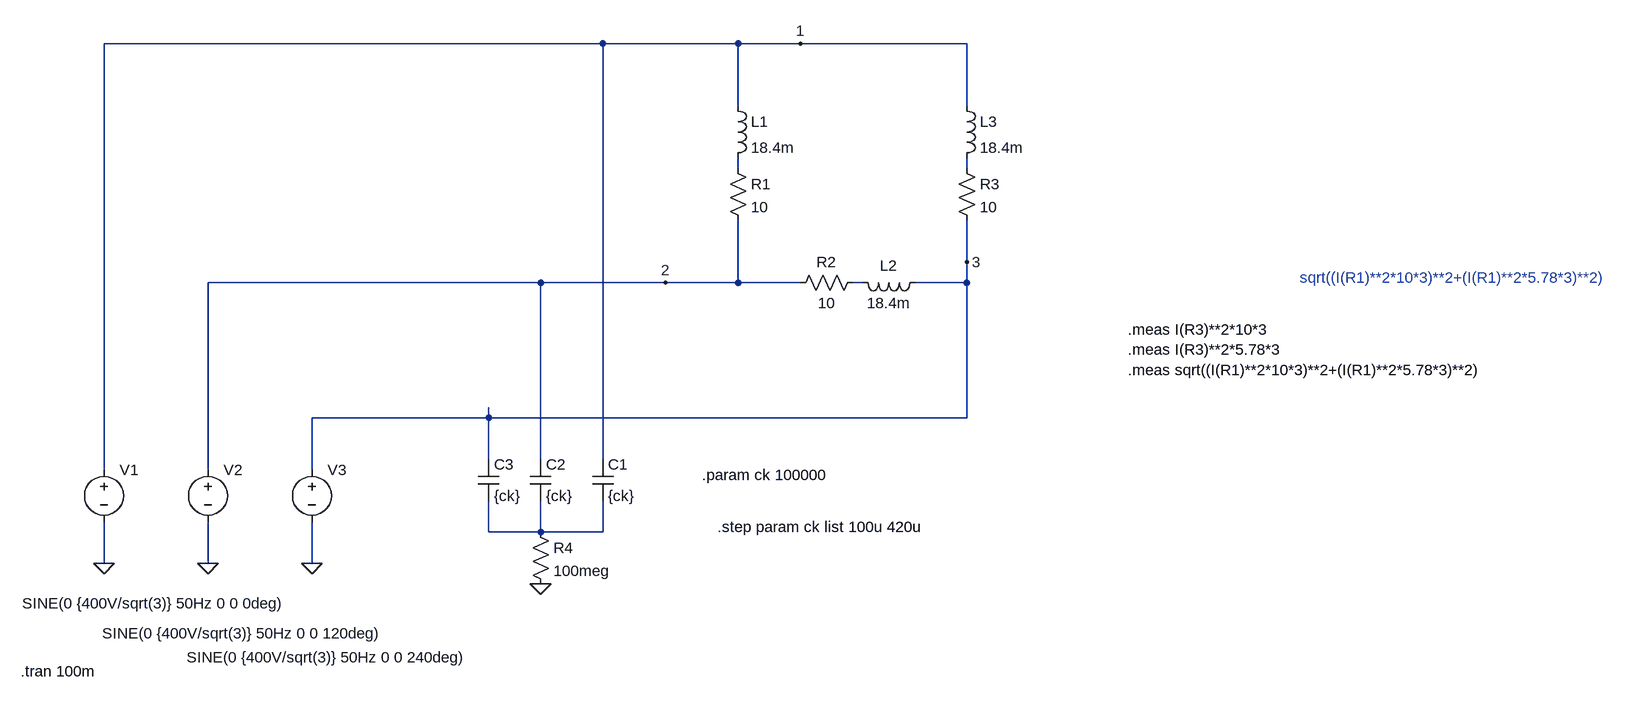
[diagram p0: schematic three-phase.asc]
three-phase.asc, the LTspice schematic file:
Version 4
SHEET 1 1540 680
WIRE -64 -416 -832 -416
WIRE 144 -416 -64 -416
WIRE 240 -416 144 -416
WIRE 496 -416 240 -416
WIRE 144 -320 144 -416
WIRE 496 -320 496 -416
WIRE 144 -224 144 -240
WIRE 496 -224 496 -240
WIRE 496 -80 496 -144
WIRE -160 -48 -672 -48
WIRE 32 -48 -160 -48
WIRE 144 -48 144 -144
WIRE 144 -48 32 -48
WIRE 240 -48 144 -48
WIRE 336 -48 320 -48
WIRE 496 -48 496 -80
WIRE 496 -48 416 -48
WIRE -240 160 -240 144
WIRE -240 160 -512 160
WIRE 496 160 496 -48
WIRE 496 160 -240 160
WIRE -240 224 -240 160
WIRE -160 224 -160 -48
WIRE -64 224 -64 -416
WIRE -832 240 -832 -416
WIRE -672 240 -672 -48
WIRE -512 240 -512 160
WIRE -240 336 -240 288
WIRE -160 336 -160 288
WIRE -160 336 -240 336
WIRE -64 336 -64 288
WIRE -64 336 -160 336
WIRE -832 384 -832 320
WIRE -672 384 -672 320
WIRE -512 384 -512 320
FLAG -832 384 0
FLAG -672 384 0
FLAG -512 384 0
FLAG 240 -416 1
FLAG 32 -48 2
FLAG 496 -80 3
FLAG -160 416 0
SYMBOL voltage -832 224 R0
WINDOW 3 -126 222 Left 0
WINDOW 123 0 0 Left 0
WINDOW 39 0 0 Left 0
SYMATTR InstName V1
SYMATTR Value SINE(0 {400V/sqrt(3)} 50Hz 0 0 0deg)
SYMBOL voltage -672 224 R0
WINDOW 3 -163 268 Left 0
WINDOW 123 0 0 Left 0
WINDOW 39 0 0 Left 0
SYMATTR InstName V2
SYMATTR Value SINE(0 {400V/sqrt(3)} 50Hz 0 0 120deg)
SYMBOL voltage -512 224 R0
WINDOW 3 -193 305 Left 0
WINDOW 123 0 0 Left 0
WINDOW 39 0 0 Left 0
SYMATTR InstName V3
SYMATTR Value SINE(0 {400V/sqrt(3)} 50Hz 0 0 240deg)
SYMBOL ind 128 -336 R0
SYMATTR InstName L1
SYMATTR Value 18.4m
SYMBOL res 128 -240 R0
SYMATTR InstName R1
SYMATTR Value 10
SYMBOL ind 432 -64 R90
WINDOW 0 5 56 VBottom 0
WINDOW 3 32 56 VTop 0
SYMATTR InstName L2
SYMATTR Value 18.4m
SYMBOL res 336 -64 R90
WINDOW 0 0 56 VBottom 0
WINDOW 3 32 56 VTop 0
SYMATTR InstName R2
SYMATTR Value 10
SYMBOL ind 480 -336 R0
SYMATTR InstName L3
SYMATTR Value 18.4m
SYMBOL res 480 -240 R0
SYMATTR InstName R3
SYMATTR Value 10
SYMBOL cap -80 224 R0
SYMATTR InstName C1
SYMATTR Value {ck}
SYMBOL cap -176 224 R0
SYMATTR InstName C2
SYMATTR Value {ck}
SYMBOL cap -256 224 R0
SYMATTR InstName C3
SYMATTR Value {ck}
SYMBOL res -176 320 R0
SYMATTR InstName R4
SYMATTR Value 100meg
TEXT -960 550 Left 0 !.tran 100m
TEXT 1008 -56 Left 0 ;sqrt((I(R1)**2*10*3)**2+(I(R1)**2*5.78*3)**2)
TEXT 88 248 Left 0 !.param ck 100000
TEXT 744 24 Left 0 !.meas I(R3)**2*10*3\n.meas I(R3)**2*5.78*3\n.meas sqrt((I(R1)**2*10*3)**2+(I(R1)**2*5.78*3)**2)
TEXT 112 328 Left 0 !.step param ck list 100u 420u

The netlist it stands for:
* three-phase.asc
V1 1 0 SINE(0 {400V/sqrt(3)} 50Hz 0 0 0deg)
V2 2 0 SINE(0 {400V/sqrt(3)} 50Hz 0 0 120deg)
V3 3 0 SINE(0 {400V/sqrt(3)} 50Hz 0 0 240deg)
L1 1 N001 18.4m
R1 N001 2 10
L2 3 N003 18.4m
R2 N003 2 10
L3 1 N002 18.4m
R3 N002 3 10
C1 1 N004 {ck}
C2 2 N004 {ck}
C3 3 N004 {ck}
R4 N004 0 100meg
.tran 100m
* sqrt((I(R1)**2*10*3)**2+(I(R1)**2*5.78*3)**2)
.param ck 100000
.meas I(R3)**2*10*3
.meas I(R3)**2*5.78*3
.meas sqrt((I(R1)**2*10*3)**2+(I(R1)**2*5.78*3)**2)
.step param ck list 100u 420u
.backanno
.end